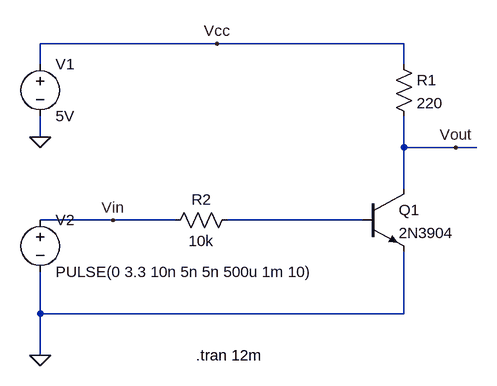
[diagram p0: schematic tran.asc]
tran.asc, the LTspice schematic file:
Version 4
SHEET 1 880 680
WIRE 368 112 96 112
WIRE 656 112 368 112
WIRE 96 144 96 112
WIRE 656 144 656 112
WIRE 96 256 96 224
WIRE 656 272 656 224
WIRE 736 272 656 272
WIRE 768 272 736 272
WIRE 656 336 656 272
WIRE 208 384 96 384
WIRE 304 384 208 384
WIRE 592 384 384 384
WIRE 96 528 96 464
WIRE 656 528 656 432
WIRE 656 528 96 528
WIRE 96 592 96 528
FLAG 96 256 0
FLAG 736 272 Vout
FLAG 368 112 Vcc
FLAG 208 384 Vin
FLAG 96 592 0
SYMBOL npn 592 336 R0
SYMATTR InstName Q1
SYMATTR Value 2N3904
SYMBOL res 640 128 R0
SYMATTR InstName R1
SYMATTR Value 220
SYMBOL res 288 400 R270
WINDOW 0 32 56 VTop 2
WINDOW 3 0 56 VBottom 2
SYMATTR InstName R2
SYMATTR Value 10k
SYMBOL voltage 96 128 R0
SYMATTR InstName V1
SYMATTR Value 5V
SYMBOL voltage 96 368 R0
SYMATTR InstName V2
SYMATTR Value PULSE(0 3.3 10n 5n 5n 500u 1m 10)
TEXT 336 592 Left 2 !.tran 12m

The netlist it stands for:
* tran.asc
Q1 Vout N001 0 0 2N3904
R1 Vcc Vout 220
R2 Vin N001 10k
V1 Vcc 0 5V
V2 Vin 0 PULSE(0 3.3 10n 5n 5n 500u 1m 10)
.model NPN NPN
.model PNP PNP
.lib standard.bjt
.tran 12m
.backanno
.end